# Altium schematic sheet thermal-system-overview.SchDoc
size A3; DrawnBy: Lorna Lan; Revision: v1
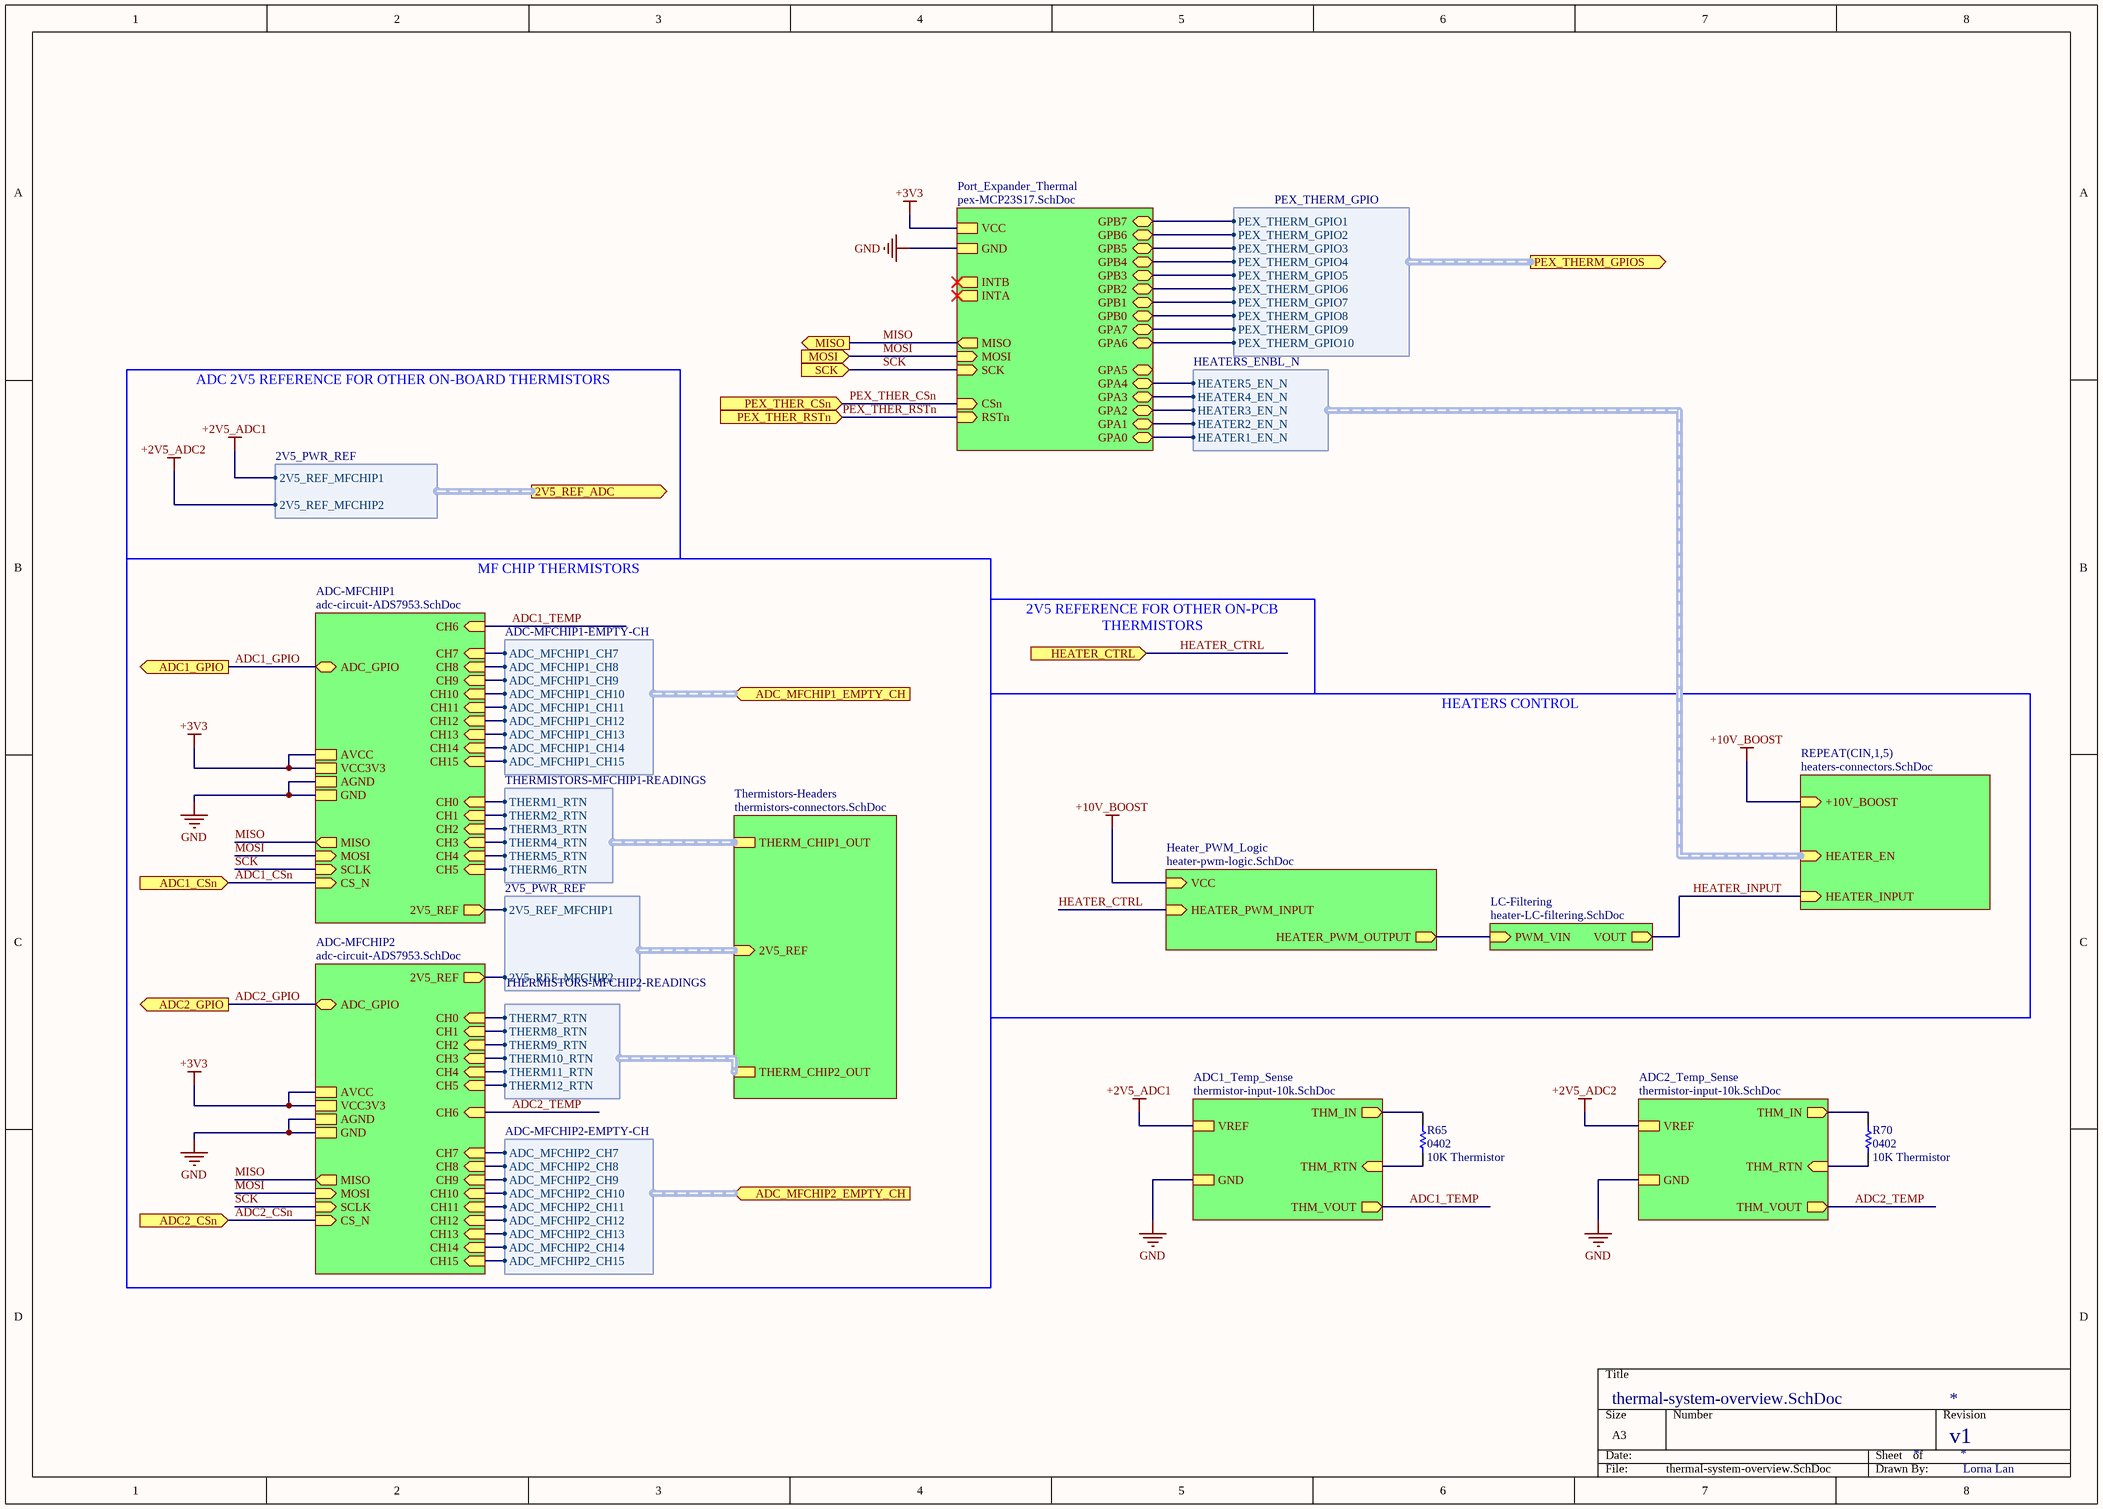
[diagram p0: thermal-system-overview.SchDoc]

## Parts
R65  0402  value 10K Thermistor  [RES0402R]
R70  0402  value 10K Thermistor  [RES0402R]

## Sub-sheets
ADC1_Temp_Sense = thermistor-input-10k.SchDoc: GND, THM_VOUT (out), VREF, THM_IN (out), THM_RTN (in)
ADC2_Temp_Sense = thermistor-input-10k.SchDoc: GND, THM_VOUT (out), VREF, THM_IN (out), THM_RTN (in)
ADC-MFCHIP1 = adc-circuit-ADS7953.SchDoc: CH4 (in), CH0 (in), CH3 (in), CH2 (in), MISO (out), MOSI (in), SCLK (in), CS_N (in), ADC_GPIO (bidir), CH1 (in), CH5 (in), 2V5_REF (out), AVCC, VCC3V3, AGND, GND, CH11 (in), CH8 (in), CH6 (in), CH7 (in), CH10 (in), CH15 (in), CH9 (in), CH12 (in), CH13 (in), CH14 (in)
ADC-MFCHIP2 = adc-circuit-ADS7953.SchDoc: CH4 (in), CH0 (in), CH3 (in), CH2 (in), CH6 (in), CH7 (in), MISO (out), MOSI (in), SCLK (in), CS_N (in), ADC_GPIO (bidir), CH1 (in), CH5 (in), 2V5_REF (out), AVCC, VCC3V3, AGND, GND, CH15 (in), CH14 (in), CH13 (in), CH12 (in), CH11 (in), CH10 (in), CH9 (in), CH8 (in)
Heater_PWM_Logic = heater-pwm-logic.SchDoc: HEATER_PWM_INPUT (in), HEATER_PWM_OUTPUT (out), VCC (in)
LC-Filtering = heater-LC-filtering.SchDoc: VOUT (out), PWM_VIN (in)
Port_Expander_Thermal = pex-MCP23S17.SchDoc: GPB7 (bidir), GPA3 (bidir), GPA0 (bidir), GPA5 (bidir), GPA6 (bidir), GPA1 (bidir), GPB5 (bidir), GPB4 (bidir), GPB1 (bidir), GPB0 (bidir), INTB (out), INTA (out), VCC, GND, GPB2 (bidir), GPB3 (bidir), GPA4 (bidir), GPA2 (bidir), GPB6 (bidir), GPA7 (bidir), MISO (out), MOSI (in), SCK (in), CSn (in), RSTn (in)
REPEAT(CIN,1,5) = heaters-connectors.SchDoc: HEATER_INPUT (in), +10V_BOOST (in), HEATER_EN (in, harness HEATERS_ENBL_N)
Thermistors-Headers = thermistors-connectors.SchDoc: 2V5_REF (in, harness 2V5_PWR_REF), THERM_CHIP1_OUT (harness THERMISTORS-MFCHIP1-READINGS), THERM_CHIP2_OUT (harness THERMISTORS-MFCHIP2-READINGS)

## Ports
2V5_REF_ADC (out, harness 2V5_PWR_REF), ADC1_CSn (in), ADC1_GPIO (out), ADC2_CSn (in), ADC2_GPIO (out), ADC_MFCHIP1_EMPTY_CH (in, harness ADC-MFCHIP1-EMPTY-CH), ADC_MFCHIP2_EMPTY_CH (in, harness ADC-MFCHIP2-EMPTY-CH), HEATER_CTRL (in), MISO (out), MOSI (in), PEX_THER_CSn (in), PEX_THER_RSTn (in), PEX_THERM_GPIOS (out, harness PEX_THERM_GPIO), SCK (in)

## Harnesses
HEATERS_ENBL_N: HEATER5_EN_N, HEATER4_EN_N, HEATER3_EN_N, HEATER2_EN_N, HEATER1_EN_N
THERMISTORS-MFCHIP1-READINGS: THERM1_RTN, THERM2_RTN, THERM3_RTN, THERM4_RTN, THERM5_RTN, THERM6_RTN
2V5_PWR_REF: 2V5_REF_MFCHIP1, 2V5_REF_MFCHIP2
THERMISTORS-MFCHIP2-READINGS: THERM7_RTN, THERM8_RTN, THERM9_RTN, THERM10_RTN, THERM11_RTN, THERM12_RTN
ADC-MFCHIP1-EMPTY-CH: ADC_MFCHIP1_CH7, ADC_MFCHIP1_CH8, ADC_MFCHIP1_CH9, ADC_MFCHIP1_CH10, ADC_MFCHIP1_CH11, ADC_MFCHIP1_CH12, ADC_MFCHIP1_CH13, ADC_MFCHIP1_CH14, ADC_MFCHIP1_CH15
ADC-MFCHIP2-EMPTY-CH: ADC_MFCHIP2_CH7, ADC_MFCHIP2_CH8, ADC_MFCHIP2_CH9, ADC_MFCHIP2_CH10, ADC_MFCHIP2_CH11, ADC_MFCHIP2_CH12, ADC_MFCHIP2_CH13, ADC_MFCHIP2_CH14, ADC_MFCHIP2_CH15
PEX_THERM_GPIO: PEX_THERM_GPIO1, PEX_THERM_GPIO2, PEX_THERM_GPIO3, PEX_THERM_GPIO4, PEX_THERM_GPIO5, PEX_THERM_GPIO6, PEX_THERM_GPIO7, PEX_THERM_GPIO8, PEX_THERM_GPIO9, PEX_THERM_GPIO10

## Nets
+2V5_ADC1: sheet ADC1_Temp_Sense/VREF, port 2V5_REF_ADC.2V5_REF_MFCHIP1
+2V5_ADC2: sheet ADC2_Temp_Sense/VREF, port 2V5_REF_ADC.2V5_REF_MFCHIP2
+3V3: sheet Port_Expander_Thermal/VCC, sheet ADC-MFCHIP1/AVCC, sheet ADC-MFCHIP1/VCC3V3, sheet ADC-MFCHIP2/AVCC, sheet ADC-MFCHIP2/VCC3V3
+10V_BOOST: sheet REPEAT(CIN,1,5)/+10V_BOOST, sheet Heater_PWM_Logic/VCC
GND: sheet Port_Expander_Thermal/GND, sheet ADC-MFCHIP1/AGND, sheet ADC-MFCHIP1/GND, sheet ADC-MFCHIP2/AGND, sheet ADC-MFCHIP2/GND, sheet ADC1_Temp_Sense/GND, sheet ADC2_Temp_Sense/GND
ADC1_CSn: port ADC1_CSn, sheet ADC-MFCHIP1/CS_N
ADC1_GPIO: port ADC1_GPIO, sheet ADC-MFCHIP1/ADC_GPIO
ADC1_TEMP: sheet ADC-MFCHIP1/CH6, sheet ADC1_Temp_Sense/THM_VOUT
ADC2_CSn: port ADC2_CSn, sheet ADC-MFCHIP2/CS_N
ADC2_GPIO: port ADC2_GPIO, sheet ADC-MFCHIP2/ADC_GPIO
ADC2_TEMP: sheet ADC-MFCHIP2/CH6, sheet ADC2_Temp_Sense/THM_VOUT
HEATER_CTRL: port HEATER_CTRL, sheet Heater_PWM_Logic/HEATER_PWM_INPUT
HEATER_INPUT: sheet REPEAT(CIN,1,5)/HEATER_INPUT, sheet LC-Filtering/VOUT
MISO: port MISO, sheet Port_Expander_Thermal/MISO, sheet ADC-MFCHIP1/MISO, sheet ADC-MFCHIP2/MISO
MOSI: port MOSI, sheet Port_Expander_Thermal/MOSI, sheet ADC-MFCHIP1/MOSI, sheet ADC-MFCHIP2/MOSI
PEX_THER_CSn: port PEX_THER_CSn, sheet Port_Expander_Thermal/CSn
PEX_THER_RSTn: port PEX_THER_RSTn, sheet Port_Expander_Thermal/RSTn
SCK: port SCK, sheet Port_Expander_Thermal/SCK, sheet ADC-MFCHIP1/SCLK, sheet ADC-MFCHIP2/SCLK
NetR65_1: R65.1 ; sheet ADC1_Temp_Sense/THM_RTN
NetR65_2: R65.2 ; sheet ADC1_Temp_Sense/THM_IN
NetR70_1: R70.1 ; sheet ADC2_Temp_Sense/THM_RTN
NetR70_2: R70.2 ; sheet ADC2_Temp_Sense/THM_IN
(unnamed): sheet Port_Expander_Thermal/GPB7, port PEX_THERM_GPIOS.PEX_THERM_GPIO1
(unnamed): sheet Port_Expander_Thermal/GPA3, sheet REPEAT(CIN,1,5)/HEATER_EN.HEATER4_EN_N
(unnamed): sheet Port_Expander_Thermal/GPA0, sheet REPEAT(CIN,1,5)/HEATER_EN.HEATER1_EN_N
(unnamed): sheet Port_Expander_Thermal/GPA6, port PEX_THERM_GPIOS.PEX_THERM_GPIO10
(unnamed): sheet Port_Expander_Thermal/GPA1, sheet REPEAT(CIN,1,5)/HEATER_EN.HEATER2_EN_N
(unnamed): sheet Port_Expander_Thermal/GPB5, port PEX_THERM_GPIOS.PEX_THERM_GPIO3
(unnamed): sheet Port_Expander_Thermal/GPB4, port PEX_THERM_GPIOS.PEX_THERM_GPIO4
(unnamed): sheet Port_Expander_Thermal/GPB1, port PEX_THERM_GPIOS.PEX_THERM_GPIO7
(unnamed): sheet Port_Expander_Thermal/GPB0, port PEX_THERM_GPIOS.PEX_THERM_GPIO8
(unnamed): sheet Port_Expander_Thermal/GPB2, port PEX_THERM_GPIOS.PEX_THERM_GPIO6
(unnamed): sheet Port_Expander_Thermal/GPB3, port PEX_THERM_GPIOS.PEX_THERM_GPIO5
(unnamed): sheet Port_Expander_Thermal/GPA4, sheet REPEAT(CIN,1,5)/HEATER_EN.HEATER5_EN_N
(unnamed): sheet Port_Expander_Thermal/GPA2, sheet REPEAT(CIN,1,5)/HEATER_EN.HEATER3_EN_N
(unnamed): sheet Port_Expander_Thermal/GPB6, port PEX_THERM_GPIOS.PEX_THERM_GPIO2
(unnamed): sheet Port_Expander_Thermal/GPA7, port PEX_THERM_GPIOS.PEX_THERM_GPIO9
(unnamed): sheet ADC-MFCHIP1/CH4, sheet Thermistors-Headers/THERM_CHIP1_OUT.THERM5_RTN
(unnamed): sheet ADC-MFCHIP1/CH0, sheet Thermistors-Headers/THERM_CHIP1_OUT.THERM1_RTN
(unnamed): sheet ADC-MFCHIP1/CH3, sheet Thermistors-Headers/THERM_CHIP1_OUT.THERM4_RTN
(unnamed): sheet ADC-MFCHIP1/CH2, sheet Thermistors-Headers/THERM_CHIP1_OUT.THERM3_RTN
(unnamed): sheet ADC-MFCHIP1/CH1, sheet Thermistors-Headers/THERM_CHIP1_OUT.THERM2_RTN
(unnamed): sheet ADC-MFCHIP1/CH5, sheet Thermistors-Headers/THERM_CHIP1_OUT.THERM6_RTN
(unnamed): sheet ADC-MFCHIP1/2V5_REF, sheet Thermistors-Headers/2V5_REF.2V5_REF_MFCHIP1
(unnamed): sheet ADC-MFCHIP1/CH11, port ADC_MFCHIP1_EMPTY_CH.ADC_MFCHIP1_CH11
(unnamed): sheet ADC-MFCHIP1/CH8, port ADC_MFCHIP1_EMPTY_CH.ADC_MFCHIP1_CH8
(unnamed): sheet ADC-MFCHIP1/CH7, port ADC_MFCHIP1_EMPTY_CH.ADC_MFCHIP1_CH7
(unnamed): sheet ADC-MFCHIP1/CH10, port ADC_MFCHIP1_EMPTY_CH.ADC_MFCHIP1_CH10
(unnamed): sheet ADC-MFCHIP1/CH15, port ADC_MFCHIP1_EMPTY_CH.ADC_MFCHIP1_CH15
(unnamed): sheet ADC-MFCHIP1/CH9, port ADC_MFCHIP1_EMPTY_CH.ADC_MFCHIP1_CH9
(unnamed): sheet ADC-MFCHIP1/CH12, port ADC_MFCHIP1_EMPTY_CH.ADC_MFCHIP1_CH12
(unnamed): sheet ADC-MFCHIP1/CH13, port ADC_MFCHIP1_EMPTY_CH.ADC_MFCHIP1_CH13
(unnamed): sheet ADC-MFCHIP1/CH14, port ADC_MFCHIP1_EMPTY_CH.ADC_MFCHIP1_CH14
(unnamed): sheet ADC-MFCHIP2/CH4, sheet Thermistors-Headers/THERM_CHIP2_OUT.THERM11_RTN
(unnamed): sheet ADC-MFCHIP2/CH0, sheet Thermistors-Headers/THERM_CHIP2_OUT.THERM7_RTN
(unnamed): sheet ADC-MFCHIP2/CH3, sheet Thermistors-Headers/THERM_CHIP2_OUT.THERM10_RTN
(unnamed): sheet ADC-MFCHIP2/CH2, sheet Thermistors-Headers/THERM_CHIP2_OUT.THERM9_RTN
(unnamed): sheet ADC-MFCHIP2/CH7, port ADC_MFCHIP2_EMPTY_CH.ADC_MFCHIP2_CH7
(unnamed): sheet ADC-MFCHIP2/CH1, sheet Thermistors-Headers/THERM_CHIP2_OUT.THERM8_RTN
(unnamed): sheet ADC-MFCHIP2/CH5, sheet Thermistors-Headers/THERM_CHIP2_OUT.THERM12_RTN
(unnamed): sheet ADC-MFCHIP2/2V5_REF, sheet Thermistors-Headers/2V5_REF.2V5_REF_MFCHIP2
(unnamed): sheet ADC-MFCHIP2/CH15, port ADC_MFCHIP2_EMPTY_CH.ADC_MFCHIP2_CH15
(unnamed): sheet ADC-MFCHIP2/CH14, port ADC_MFCHIP2_EMPTY_CH.ADC_MFCHIP2_CH14
(unnamed): sheet ADC-MFCHIP2/CH13, port ADC_MFCHIP2_EMPTY_CH.ADC_MFCHIP2_CH13
(unnamed): sheet ADC-MFCHIP2/CH12, port ADC_MFCHIP2_EMPTY_CH.ADC_MFCHIP2_CH12
(unnamed): sheet ADC-MFCHIP2/CH11, port ADC_MFCHIP2_EMPTY_CH.ADC_MFCHIP2_CH11
(unnamed): sheet ADC-MFCHIP2/CH10, port ADC_MFCHIP2_EMPTY_CH.ADC_MFCHIP2_CH10
(unnamed): sheet ADC-MFCHIP2/CH9, port ADC_MFCHIP2_EMPTY_CH.ADC_MFCHIP2_CH9
(unnamed): sheet ADC-MFCHIP2/CH8, port ADC_MFCHIP2_EMPTY_CH.ADC_MFCHIP2_CH8
(unnamed): sheet LC-Filtering/PWM_VIN, sheet Heater_PWM_Logic/HEATER_PWM_OUTPUT

## Notes on the sheet
- ADC 2V5 REFERENCE FOR OTHER ON-BOARD THERMISTORS
- 2V5 REFERENCE FOR OTHER ON-PCB THERMISTORS
- HEATERS CONTROL
- MF CHIP THERMISTORS

## Library data of the parts
R65 R70 = RES0402: 0402 resistor